# Altium schematic sheet RasPi.SchDoc
size A
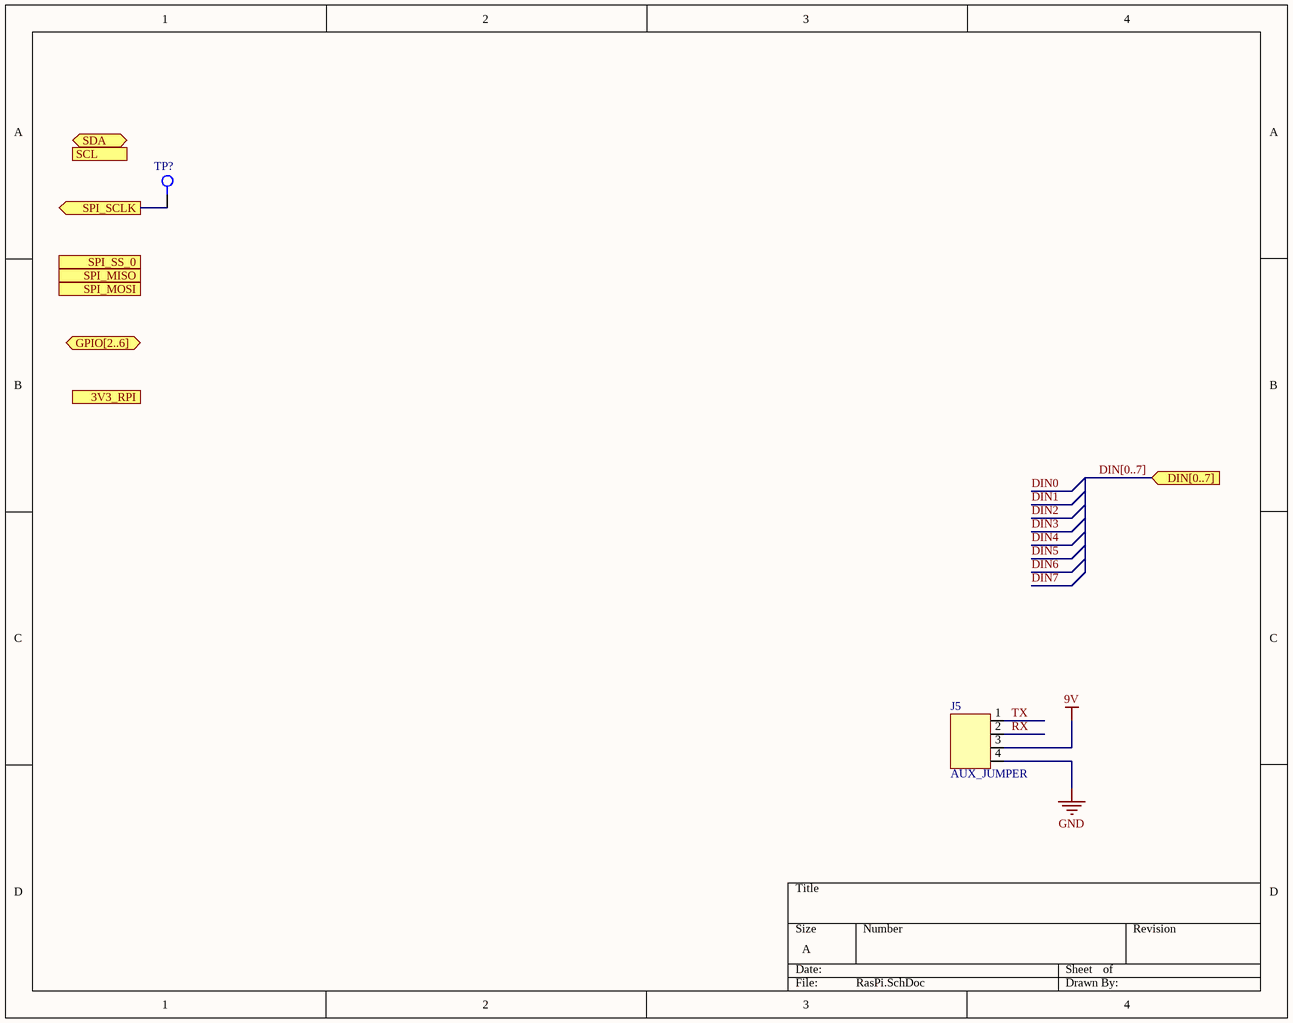
[diagram p0: RasPi.SchDoc]

## Parts
J5  AUX_JUMPER  [HEADERPINS_2x2]
TP?  TP  [TP_5029]  (value not drawn)

## Ports
3V3_RPI (out), DIN[0..7] (in), GPIO[2..6] (bidir), SCL (out), SDA (bidir), SPI_MISO (in), SPI_MOSI (out), SPI_SCLK (out), SPI_SS_0 (in)

## Nets
9V: J5.3(SDA)
GND: J5.4(SCL)
RX: J5.2(3V3)
SPI_SCLK: TP?.1 ; port SPI_SCLK
TX: J5.1(GND)

## Buses and harness runs
bus DIN[0..7] = port DIN[0..7]

## Library data of the parts
J5 = J4: Supplier 1: Digi-Key; Supplier Part Number 1: SAM10843-ND
TP? = TP: RCT-0C SMD 0805 TP; Supplier 1: Digi-Key; Supplier Part Number 1: A106144CT-ND